# Altium schematic sheet LPEDT_revA1_bikeit_DEBUG_MECH.SchDoc: Debug Header Mechanical
size A; Author: Dhruva Koley; DocumentNumber: 7; Revision: 1; SheetNumber: 7; SheetTotal: 12
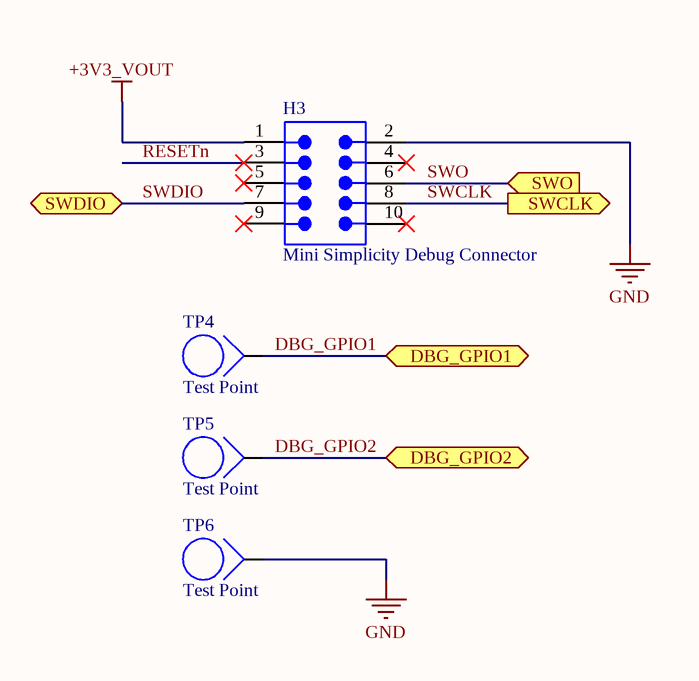
[diagram p0: LPEDT_revA1_bikeit_DEBUG_MECH.SchDoc]

## Parts
H3  Mini Simplicity Debug Connector
TP4  Test Point
TP5  Test Point
TP6  Test Point

## Ports
DBG_GPIO1 (bidir), DBG_GPIO2 (bidir), SWCLK (out), SWDIO (bidir), SWO (in)

## Nets
+3V3_VOUT: H3.1
GND: H3.2 TP6.1
DBG_GPIO1: TP4.1 ; port DBG_GPIO1
DBG_GPIO2: TP5.1 ; port DBG_GPIO2
RESETn: H3.3
SWCLK: H3.8 ; port SWCLK
SWDIO: H3.7 ; port SWDIO
SWO: H3.6 ; port SWO

Not connected (* = marked no-connect by the designer): H3 4* 5* 9* 10*

## Library data of the parts
H3 = FTSH-105-01-LM-DV-K: Conn Unshrouded Header HDR 10 POS 1.27mm Solder ST SMD Tube; Manufacturer: Samtec; Gender: Male; Number of Contacts: 10; Supplier 1: Digi-Key; Manufacturer Part Number: FTSH-105-01-LM-DV-K; RoHS: Yes; Category: Connectors; Stock 1: 2459; Pricing 1: 1=2.93000, 10=2.81700, 100=2.34750, 500=1.99536, 1000=1.70192, 5000=1.52586 (USD); Housing Material: Polymer; Housing Color: Black; Contact Plating: Gold; Contact Material: Bronze; Min Operating Temperature: -55°C; Max Operating Temperature: 125°C; Orientation: Straight; Number of Rows: 2; Packaging: Rail/Tube; Termination: Solder; Length: 6.35mm; Pitch: 1.27mm; Depth: 3.43mm; Radiation Hardening: No; ComponentLink1URL: https://datasheet.ciiva.com/16689/ftsh-mt-16689356.pdf?src-supplier=Avnet+Europe; ComponentLink1Description: https://datasheet.ciiva.com/16689/ftsh-mt-16689356.pdf?src-supplier=Avnet+Europe; ComponentLink2URL: https://datasheet.ciiva.com/10245/ftsh-mt-10245149.pdf?src-supplier=Avnet; ComponentLink2Description: https://datasheet.ciiva.com/10245/ftsh-mt-10245149.pdf?src-supplier=Avnet; Supplier Part Number 1: SAM9441-ND
TP4-TP6 = Test Pad